# Altium schematic sheet Hardware_Architecture.SchDoc: Apalis Evaluation Board 1.1
size A3; Organization: Toradex AG; Address1: Altsagenstrasse 5; Address2: Horw; Address3: 6048; Address4: Switzerland; DocumentNumber: 2; Revision: V1.1; SheetNumber: 2; SheetTotal: 32; PageSetup: Record=PageOptions|CenterHorizontal=True|CenterVertical=True|PrintScale=0.73|XCorrection=1.00|YCorrection=1.00|PrintKind=0|BorderSize=5000000|LeftOffset=0|BottomOffset=0|Orientation=2|PaperLength=1000|PaperWidth=1000|Scale=100|PaperSource=7|PrintQuality=600|MediaType=1|DitherType=10|PaperKind=A4|PrintScaleMode=1
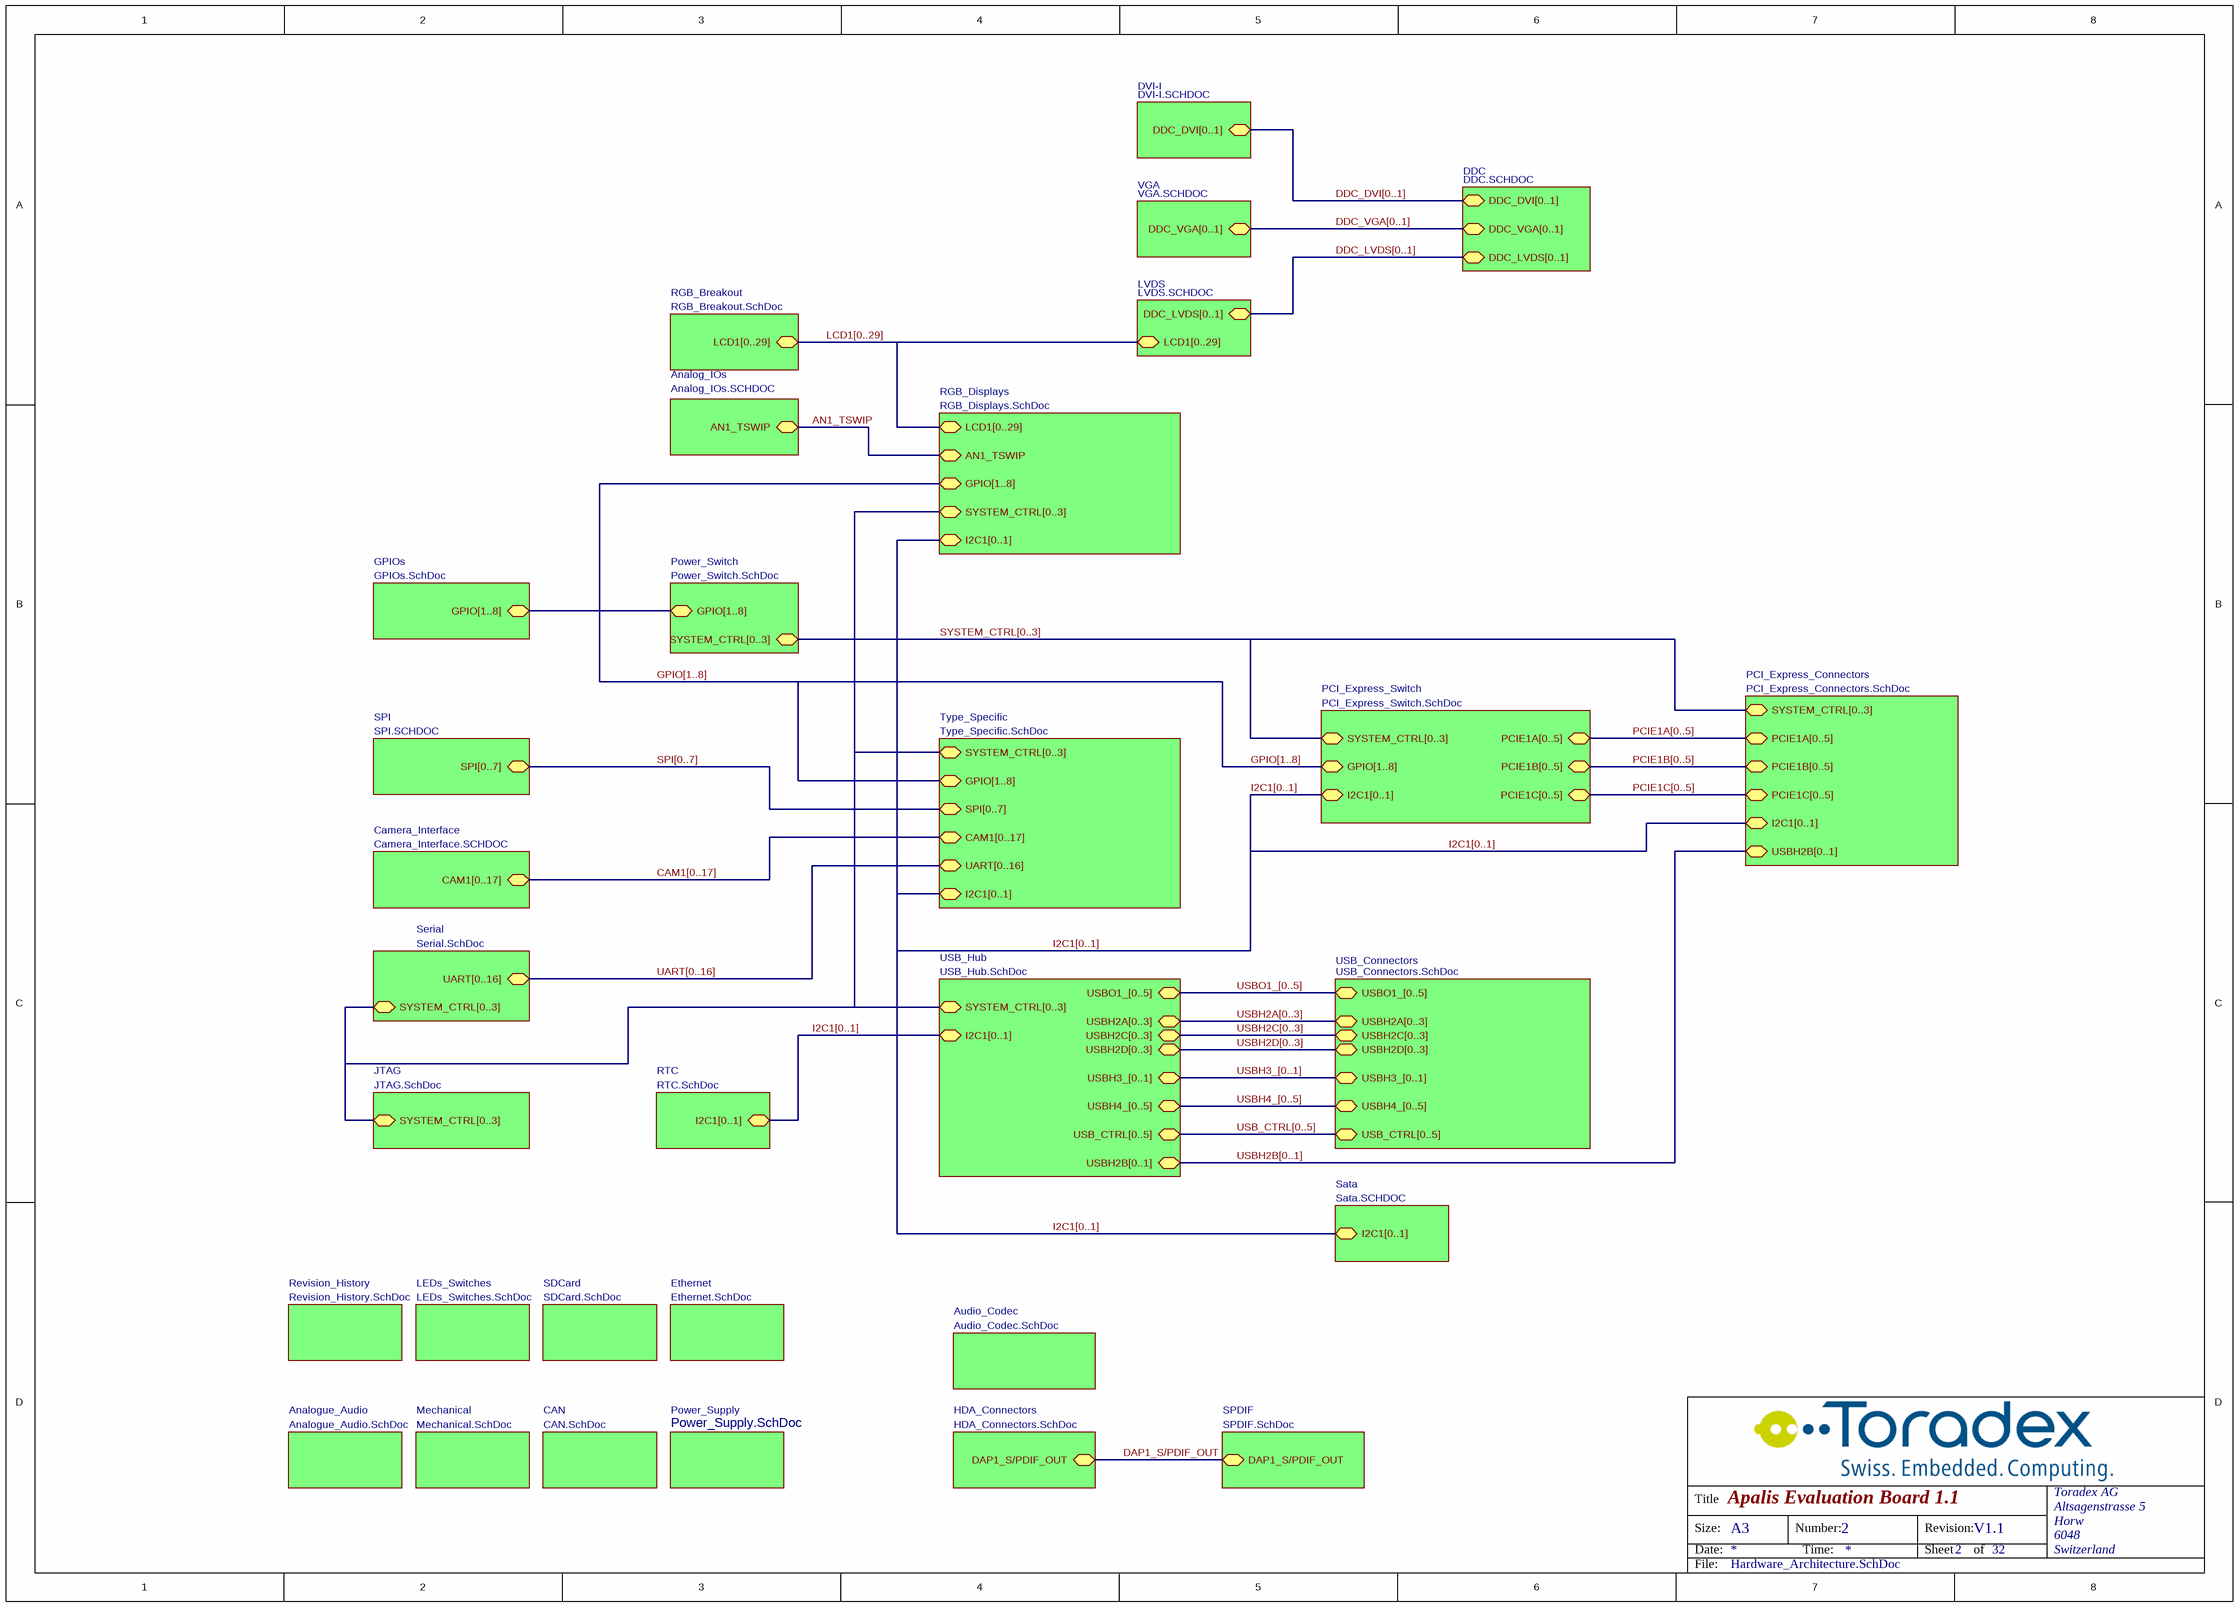
[diagram p0: Hardware_Architecture.SchDoc]

## Sub-sheets
Analog_IOs = Analog_IOs.SCHDOC: AN1_TSWIP (bidir)
Analogue_Audio = Analogue_Audio.SchDoc: no entries
Audio_Codec = Audio_Codec.SchDoc: no entries
Camera_Interface = Camera_Interface.SCHDOC: CAM1[0..17] (bidir)
CAN = CAN.SchDoc: no entries
DDC = DDC.SCHDOC: DDC_VGA[0..1] (bidir), DDC_DVI[0..1] (bidir), DDC_LVDS[0..1] (bidir)
DVI-I = DVI-I.SCHDOC: DDC_DVI[0..1] (bidir)
Ethernet = Ethernet.SchDoc: no entries
GPIOs = GPIOs.SchDoc: GPIO[1..8] (bidir)
HDA_Connectors = HDA_Connectors.SchDoc: DAP1_S/PDIF_OUT (bidir)
JTAG = JTAG.SchDoc: SYSTEM_CTRL[0..3] (bidir)
LEDs_Switches = LEDs_Switches.SchDoc: no entries
LVDS = LVDS.SCHDOC: DDC_LVDS[0..1] (bidir), LCD1[0..29] (bidir)
Mechanical = Mechanical.SchDoc: no entries
PCI_Express_Connectors = PCI_Express_Connectors.SchDoc: PCIE1A[0..5] (bidir), PCIE1B[0..5] (bidir), PCIE1C[0..5] (bidir), I2C1[0..1] (bidir), USBH2B[0..1] (bidir), SYSTEM_CTRL[0..3] (bidir)
PCI_Express_Switch = PCI_Express_Switch.SchDoc: PCIE1A[0..5] (bidir), PCIE1B[0..5] (bidir), PCIE1C[0..5] (bidir), I2C1[0..1] (bidir), SYSTEM_CTRL[0..3] (bidir), GPIO[1..8] (bidir)
Power_Supply = Power_Supply.SchDoc: no entries
Power_Switch = Power_Switch.SchDoc: SYSTEM_CTRL[0..3] (bidir), GPIO[1..8] (bidir)
Revision_History = Revision_History.SchDoc: no entries
RGB_Breakout = RGB_Breakout.SchDoc: LCD1[0..29] (bidir)
RGB_Displays = RGB_Displays.SchDoc: LCD1[0..29] (bidir), AN1_TSWIP (bidir), SYSTEM_CTRL[0..3] (bidir), I2C1[0..1] (bidir), GPIO[1..8] (bidir)
RTC = RTC.SchDoc: I2C1[0..1] (bidir)
Sata = Sata.SCHDOC: I2C1[0..1] (bidir)
SDCard = SDCard.SchDoc: no entries
Serial = Serial.SchDoc: UART[0..16] (bidir), SYSTEM_CTRL[0..3] (bidir)
SPDIF = SPDIF.SchDoc: DAP1_S/PDIF_OUT (bidir)
SPI = SPI.SCHDOC: SPI[0..7] (bidir)
Type_Specific = Type_Specific.SchDoc: GPIO[1..8] (bidir), SPI[0..7] (bidir), SYSTEM_CTRL[0..3] (bidir), I2C1[0..1] (bidir), CAM1[0..17] (bidir), UART[0..16] (bidir)
USB_Connectors = USB_Connectors.SchDoc: USBO1_[0..5] (bidir), USBH4_[0..5] (bidir), USBH2D[0..3] (bidir), USBH2C[0..3] (bidir), USBH3_[0..1] (bidir), USB_CTRL[0..5] (bidir), USBH2A[0..3] (bidir)
USB_Hub = USB_Hub.SchDoc: I2C1[0..1] (bidir), USBH2A[0..3] (bidir), USBH2B[0..1] (bidir), USBH2C[0..3] (bidir), USBH2D[0..3] (bidir), USBO1_[0..5] (bidir), USBH4_[0..5] (bidir), USBH3_[0..1] (bidir), USB_CTRL[0..5] (bidir), SYSTEM_CTRL[0..3] (bidir)
VGA = VGA.SCHDOC: DDC_VGA[0..1] (bidir)

## Nets
AN1_TSWIP: sheet Analog_IOs/AN1_TSWIP, sheet RGB_Displays/AN1_TSWIP
DAP1_S/PDIF_OUT: sheet HDA_Connectors/DAP1_S/PDIF_OUT, sheet SPDIF/DAP1_S/PDIF_OUT

## Buses and harness runs
bus CAM1[0..17] = sheet Camera_Interface/CAM1[0..17] = sheet Type_Specific/CAM1[0..17]
bus DDC_DVI[0..1] = sheet DDC/DDC_DVI[0..1] = sheet DVI-I/DDC_DVI[0..1]
bus DDC_LVDS[0..1] = sheet DDC/DDC_LVDS[0..1] = sheet LVDS/DDC_LVDS[0..1]
bus DDC_VGA[0..1] = sheet DDC/DDC_VGA[0..1] = sheet VGA/DDC_VGA[0..1]
bus GPIO[1..8] = sheet GPIOs/GPIO[1..8] = sheet PCI_Express_Switch/GPIO[1..8] = sheet Power_Switch/GPIO[1..8] = sheet RGB_Displays/GPIO[1..8] = sheet Type_Specific/GPIO[1..8]
bus I2C1[0..1] = sheet PCI_Express_Connectors/I2C1[0..1] = sheet PCI_Express_Switch/I2C1[0..1] = sheet RGB_Displays/I2C1[0..1] = sheet RTC/I2C1[0..1] = sheet Sata/I2C1[0..1] = sheet Type_Specific/I2C1[0..1] = sheet USB_Hub/I2C1[0..1]
bus LCD1[0..29] = sheet LVDS/LCD1[0..29] = sheet RGB_Breakout/LCD1[0..29] = sheet RGB_Displays/LCD1[0..29]
bus PCIE1A[0..5] = sheet PCI_Express_Connectors/PCIE1A[0..5] = sheet PCI_Express_Switch/PCIE1A[0..5]
bus PCIE1B[0..5] = sheet PCI_Express_Connectors/PCIE1B[0..5] = sheet PCI_Express_Switch/PCIE1B[0..5]
bus PCIE1C[0..5] = sheet PCI_Express_Connectors/PCIE1C[0..5] = sheet PCI_Express_Switch/PCIE1C[0..5]
bus SPI[0..7] = sheet SPI/SPI[0..7] = sheet Type_Specific/SPI[0..7]
bus SYSTEM_CTRL[0..3] = sheet JTAG/SYSTEM_CTRL[0..3] = sheet PCI_Express_Connectors/SYSTEM_CTRL[0..3] = sheet PCI_Express_Switch/SYSTEM_CTRL[0..3] = sheet Power_Switch/SYSTEM_CTRL[0..3] = sheet RGB_Displays/SYSTEM_CTRL[0..3] = sheet Serial/SYSTEM_CTRL[0..3] = sheet Type_Specific/SYSTEM_CTRL[0..3] = sheet USB_Hub/SYSTEM_CTRL[0..3]
bus UART[0..16] = sheet Serial/UART[0..16] = sheet Type_Specific/UART[0..16]
bus USB_CTRL[0..5] = sheet USB_Connectors/USB_CTRL[0..5] = sheet USB_Hub/USB_CTRL[0..5]
bus USBH2A[0..3] = sheet USB_Connectors/USBH2A[0..3] = sheet USB_Hub/USBH2A[0..3]
bus USBH2B[0..1] = sheet PCI_Express_Connectors/USBH2B[0..1] = sheet USB_Hub/USBH2B[0..1]
bus USBH2C[0..3] = sheet USB_Connectors/USBH2C[0..3] = sheet USB_Hub/USBH2C[0..3]
bus USBH2D[0..3] = sheet USB_Connectors/USBH2D[0..3] = sheet USB_Hub/USBH2D[0..3]
bus USBH3_[0..1] = sheet USB_Connectors/USBH3_[0..1] = sheet USB_Hub/USBH3_[0..1]
bus USBH4_[0..5] = sheet USB_Connectors/USBH4_[0..5] = sheet USB_Hub/USBH4_[0..5]
bus USBO1_[0..5] = sheet USB_Connectors/USBO1_[0..5] = sheet USB_Hub/USBO1_[0..5]

## Notes on the sheet
- Title
- Size:
- Date:
- A3
- Number:
- Time:
- Revision:
- Sheet
- of
- File: